# Altium schematic sheet 02_Power_diag.SchDoc: Power diagram
size A3; Organization: Lime Microsystems; Address1: Surrey Tech Centre; Address2: Guildford GU2 7YG; Address3: Surrey; Address4: United Kingdom; DocumentNumber: 2; Revision: v1.0; SheetNumber: 2; SheetTotal: 5
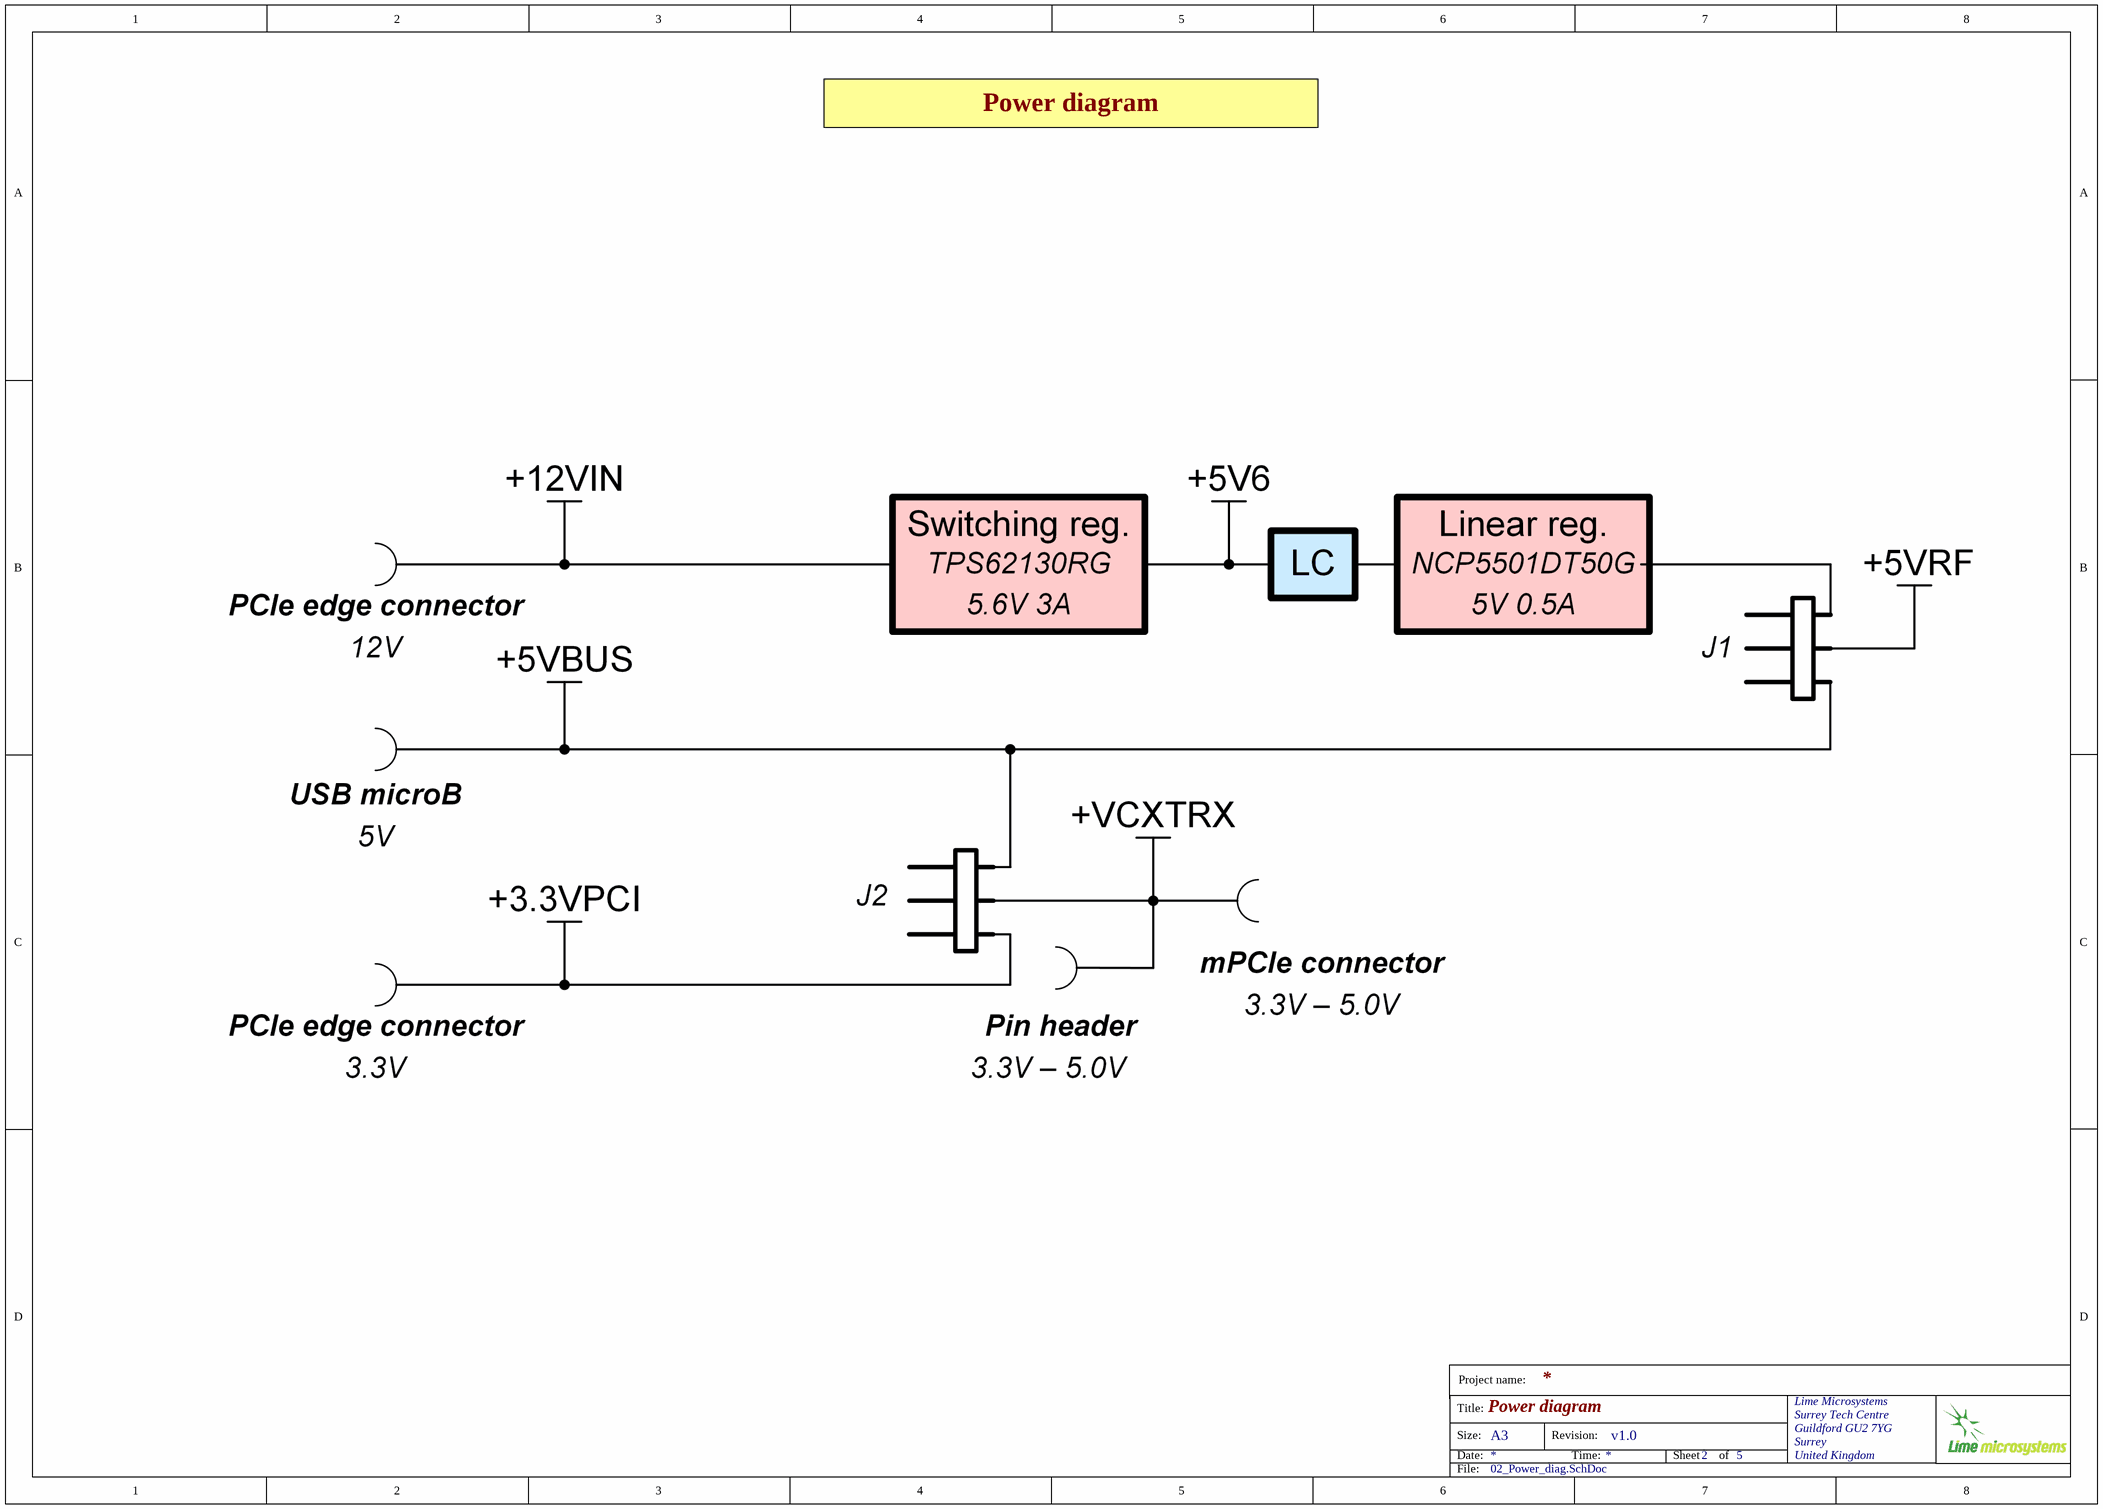
[diagram p0: 02_Power_diag.SchDoc]

## Notes on the sheet
- Power diagram
- Project name:
- Title:
- Size:
- Date:
- A3
- Revision:
- Time:
- Sheet
- of
- File: